# Altium schematic sheet [02] - BLOCK DIAGRAM.SchDoc
size A2; DocumentNumber: 2; SheetNumber: 2; SheetTotal: 13; NameAuthor: Angle Vu
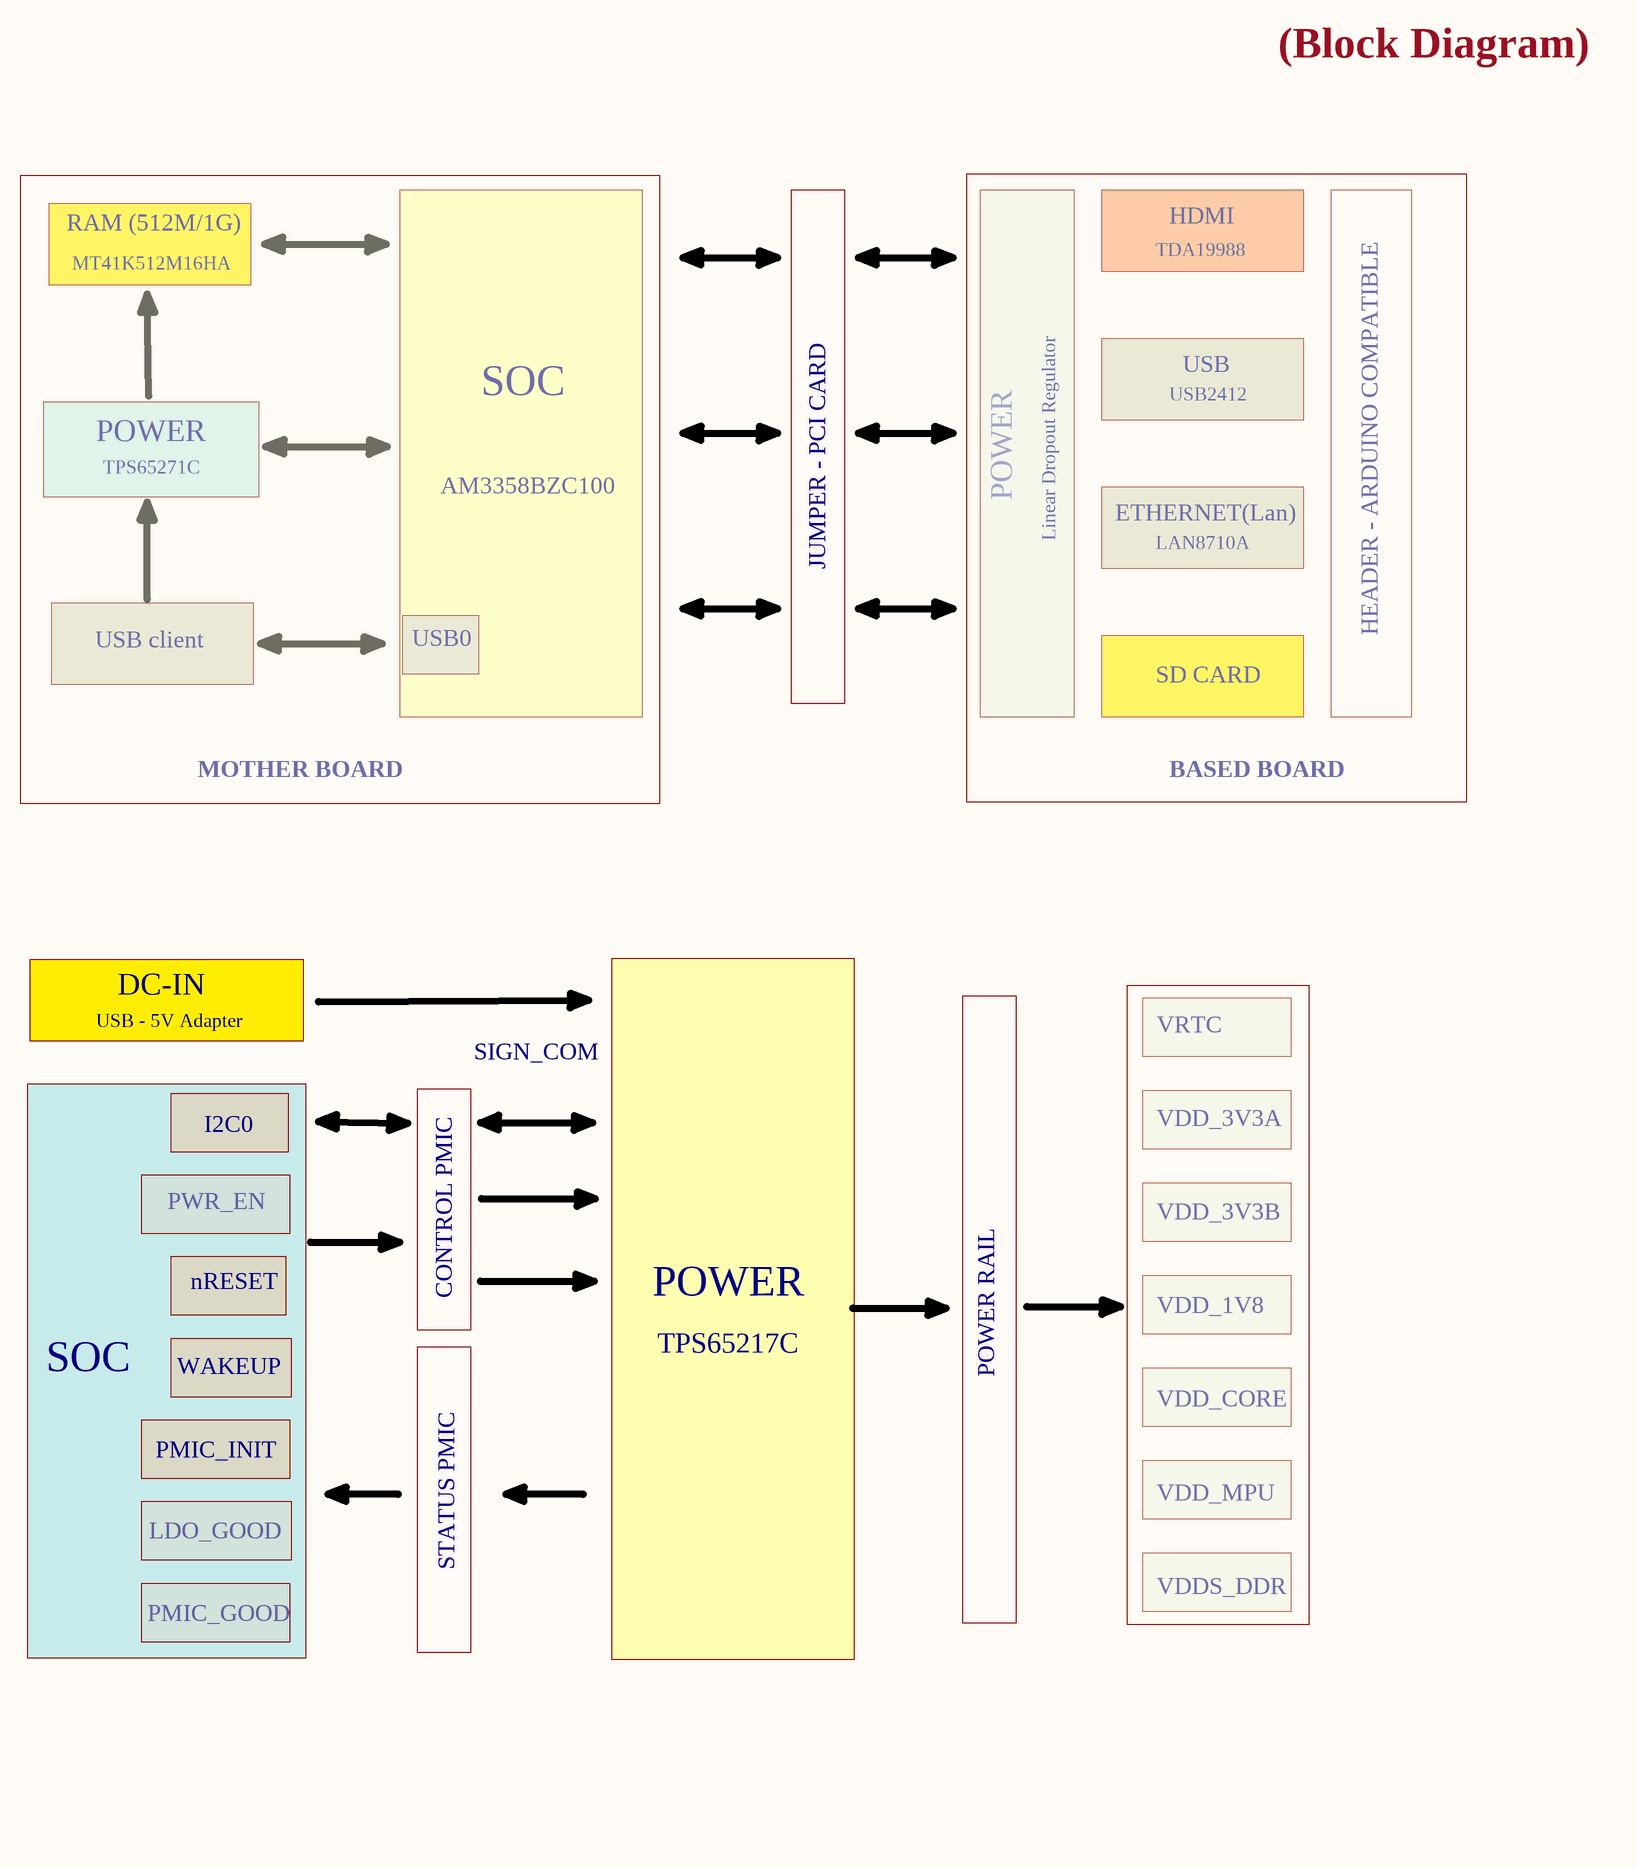
[diagram p0: [02] - BLOCK DIAGRAM.SchDoc]

## Notes on the sheet
- (Block Diagram)
- RAM (512M/1G)
- TDA19988
- HDMI
- MT41K512M16HA
- USB
- POWER
- SOC
- USB2412
- TPS65271C
- AM3358BZC100
- ETHERNET(Lan)
- JUMPER - PCI CARD
- Linear Dropout Regulator
- LAN8710A
- USB client
- USB0
- HEADER - ARDUINO COMPATIBLE
- SD CARD
- MOTHER BOARD
- BASED BOARD
- DC-IN
- USB - 5V Adapter
- SIGN_COM
- VRTC
- VDD_3V3A
- I2C0
- PWR_EN
- VDD_3V3B
- nRESET
- CONTROL PMIC
- VDD_1V8
- WAKEUP
- TPS65217C
- POWER RAIL
- PMIC_INIT
- VDD_CORE
- VDD_MPU
- LDO_GOOD
- STATUS PMIC
- VDDS_DDR
- PMIC_GOOD
- CLOCKS (CPU & PCIE)
- Designed By
- Checked By
- Page Name:
- Size:
- A2
- Company:
- Address:
- Sheet:
- /